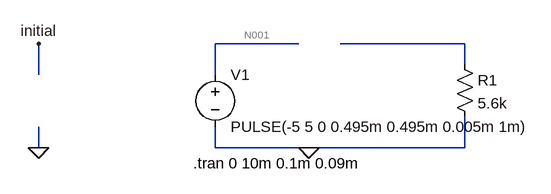
[diagram p0: schematic Draft44.asc]
Draft44.asc, the LTspice schematic file:
Version 4
SHEET 1 880 680
WIRE 336 32 208 32
WIRE 592 32 400 32
WIRE 592 64 592 32
WIRE -64 80 -64 32
WIRE 208 80 208 32
WIRE -64 192 -64 160
WIRE 208 192 208 160
WIRE 352 192 208 192
WIRE 592 192 592 144
WIRE 592 192 352 192
FLAG 352 192 0
FLAG -64 32 initial
FLAG -64 192 0
SYMBOL voltage 208 64 R0
WINDOW 123 0 0 Left 0
WINDOW 39 0 0 Left 0
SYMATTR InstName V1
SYMATTR Value PULSE(-5 5 0 0.495m 0.495m 0.005m 1m)
SYMBOL res 576 48 R0
SYMATTR InstName R1
SYMATTR Value 5.6k
TEXT 174 216 Left 2 !.tran 0 10m 0.1m 0.09m

The netlist it stands for:
* Draft44.asc
V1 N001 0 PULSE(-5 5 0 0.495m 0.495m 0.005m 1m)
R1 N002 0 5.6k
.tran 0 10m 0.1m 0.09m
.backanno
.end

* Results of the author's LTspice run, read from the files saved beside the schematic
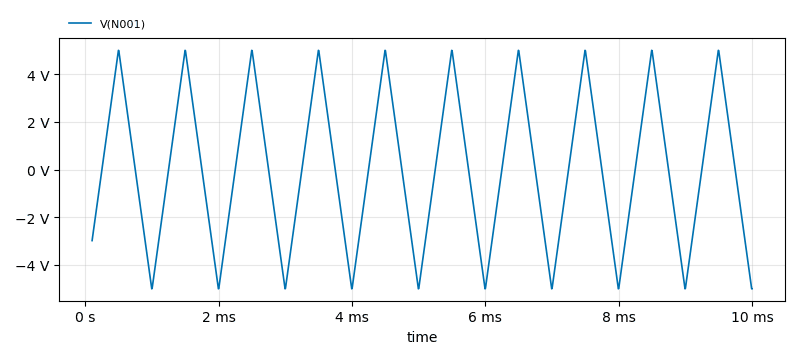
[diagram p1: Transient Analysis of Draft44.asc, plotted from the saved traces]
* Transient Analysis, 1 run:
*   V(N001): min -5 V, max 5 V, average 40.3 mV, rms 4.908 V, last -5 V